# Altium schematic sheet opo_v4.SchDoc: OPO
size Letter; Author: Kuo, Huang; Revision: 4.0; SheetNumber: 3; SheetTotal: 7
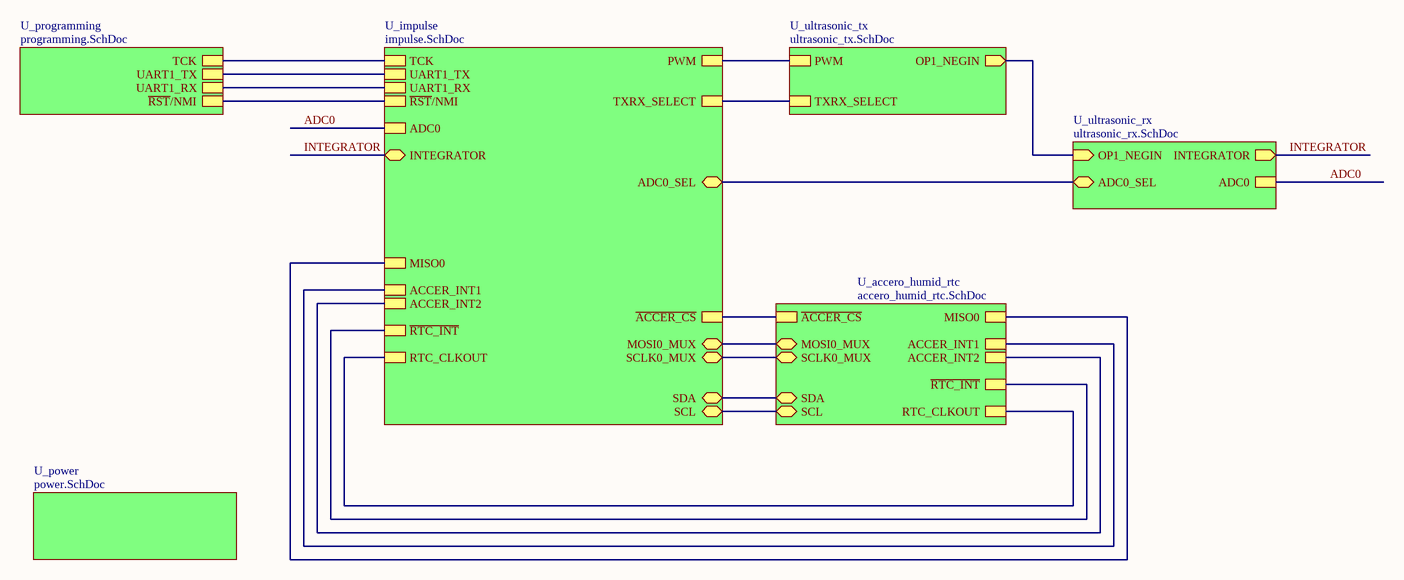
[diagram p0: opo_v4.SchDoc]

## Sub-sheets
U_accero_humid_rtc = accero_humid_rtc.SchDoc: ~{ACCER_CS}, MISO0, ACCER_INT1, ACCER_INT2, ~{RTC_INT}, RTC_CLKOUT, SDA, SCL, MOSI0_MUX, SCLK0_MUX
U_impulse = impulse.SchDoc: TCK, UART1_TX, UART1_RX, ~{RST}/NMI, ADC0, TXRX_SELECT, PWM, ~{ACCER_CS}, MISO0, ACCER_INT1, ACCER_INT2, ~{RTC_INT}, RTC_CLKOUT, INTEGRATOR, ADC0_SEL, SDA, SCL, MOSI0_MUX, SCLK0_MUX
U_power = power.SchDoc: no entries
U_programming = programming.SchDoc: TCK, UART1_TX, UART1_RX, ~{RST}/NMI
U_ultrasonic_rx = ultrasonic_rx.SchDoc: ADC0, OP1_NEGIN (in), INTEGRATOR (out), ADC0_SEL
U_ultrasonic_tx = ultrasonic_tx.SchDoc: PWM, OP1_NEGIN (out), TXRX_SELECT

## Nets
ADC0: sheet U_impulse/ADC0, sheet U_ultrasonic_rx/ADC0
INTEGRATOR: sheet U_impulse/INTEGRATOR, sheet U_ultrasonic_rx/INTEGRATOR
(unnamed): sheet U_impulse/TCK, sheet U_programming/TCK
(unnamed): sheet U_impulse/UART1_TX, sheet U_programming/UART1_TX
(unnamed): sheet U_impulse/UART1_RX, sheet U_programming/UART1_RX
(unnamed): sheet U_impulse/~{RST}/NMI, sheet U_programming/~{RST}/NMI
(unnamed): sheet U_impulse/TXRX_SELECT, sheet U_ultrasonic_tx/TXRX_SELECT
(unnamed): sheet U_impulse/PWM, sheet U_ultrasonic_tx/PWM
(unnamed): sheet U_impulse/~{ACCER_CS}, sheet U_accero_humid_rtc/~{ACCER_CS}
(unnamed): sheet U_impulse/MISO0, sheet U_accero_humid_rtc/MISO0
(unnamed): sheet U_impulse/ACCER_INT1, sheet U_accero_humid_rtc/ACCER_INT1
(unnamed): sheet U_impulse/ACCER_INT2, sheet U_accero_humid_rtc/ACCER_INT2
(unnamed): sheet U_impulse/~{RTC_INT}, sheet U_accero_humid_rtc/~{RTC_INT}
(unnamed): sheet U_impulse/RTC_CLKOUT, sheet U_accero_humid_rtc/RTC_CLKOUT
(unnamed): sheet U_impulse/ADC0_SEL, sheet U_ultrasonic_rx/ADC0_SEL
(unnamed): sheet U_impulse/SDA, sheet U_accero_humid_rtc/SDA
(unnamed): sheet U_impulse/SCL, sheet U_accero_humid_rtc/SCL
(unnamed): sheet U_impulse/MOSI0_MUX, sheet U_accero_humid_rtc/MOSI0_MUX
(unnamed): sheet U_impulse/SCLK0_MUX, sheet U_accero_humid_rtc/SCLK0_MUX
(unnamed): sheet U_ultrasonic_rx/OP1_NEGIN, sheet U_ultrasonic_tx/OP1_NEGIN

## Notes on the sheet
- Title
- Date:
- Author:
- Revision:
- Sheet
- of
- University of Michigan
- File: